# EAGLE design T14_SuperDuper_V_006 (EAGLE 7.1.0)
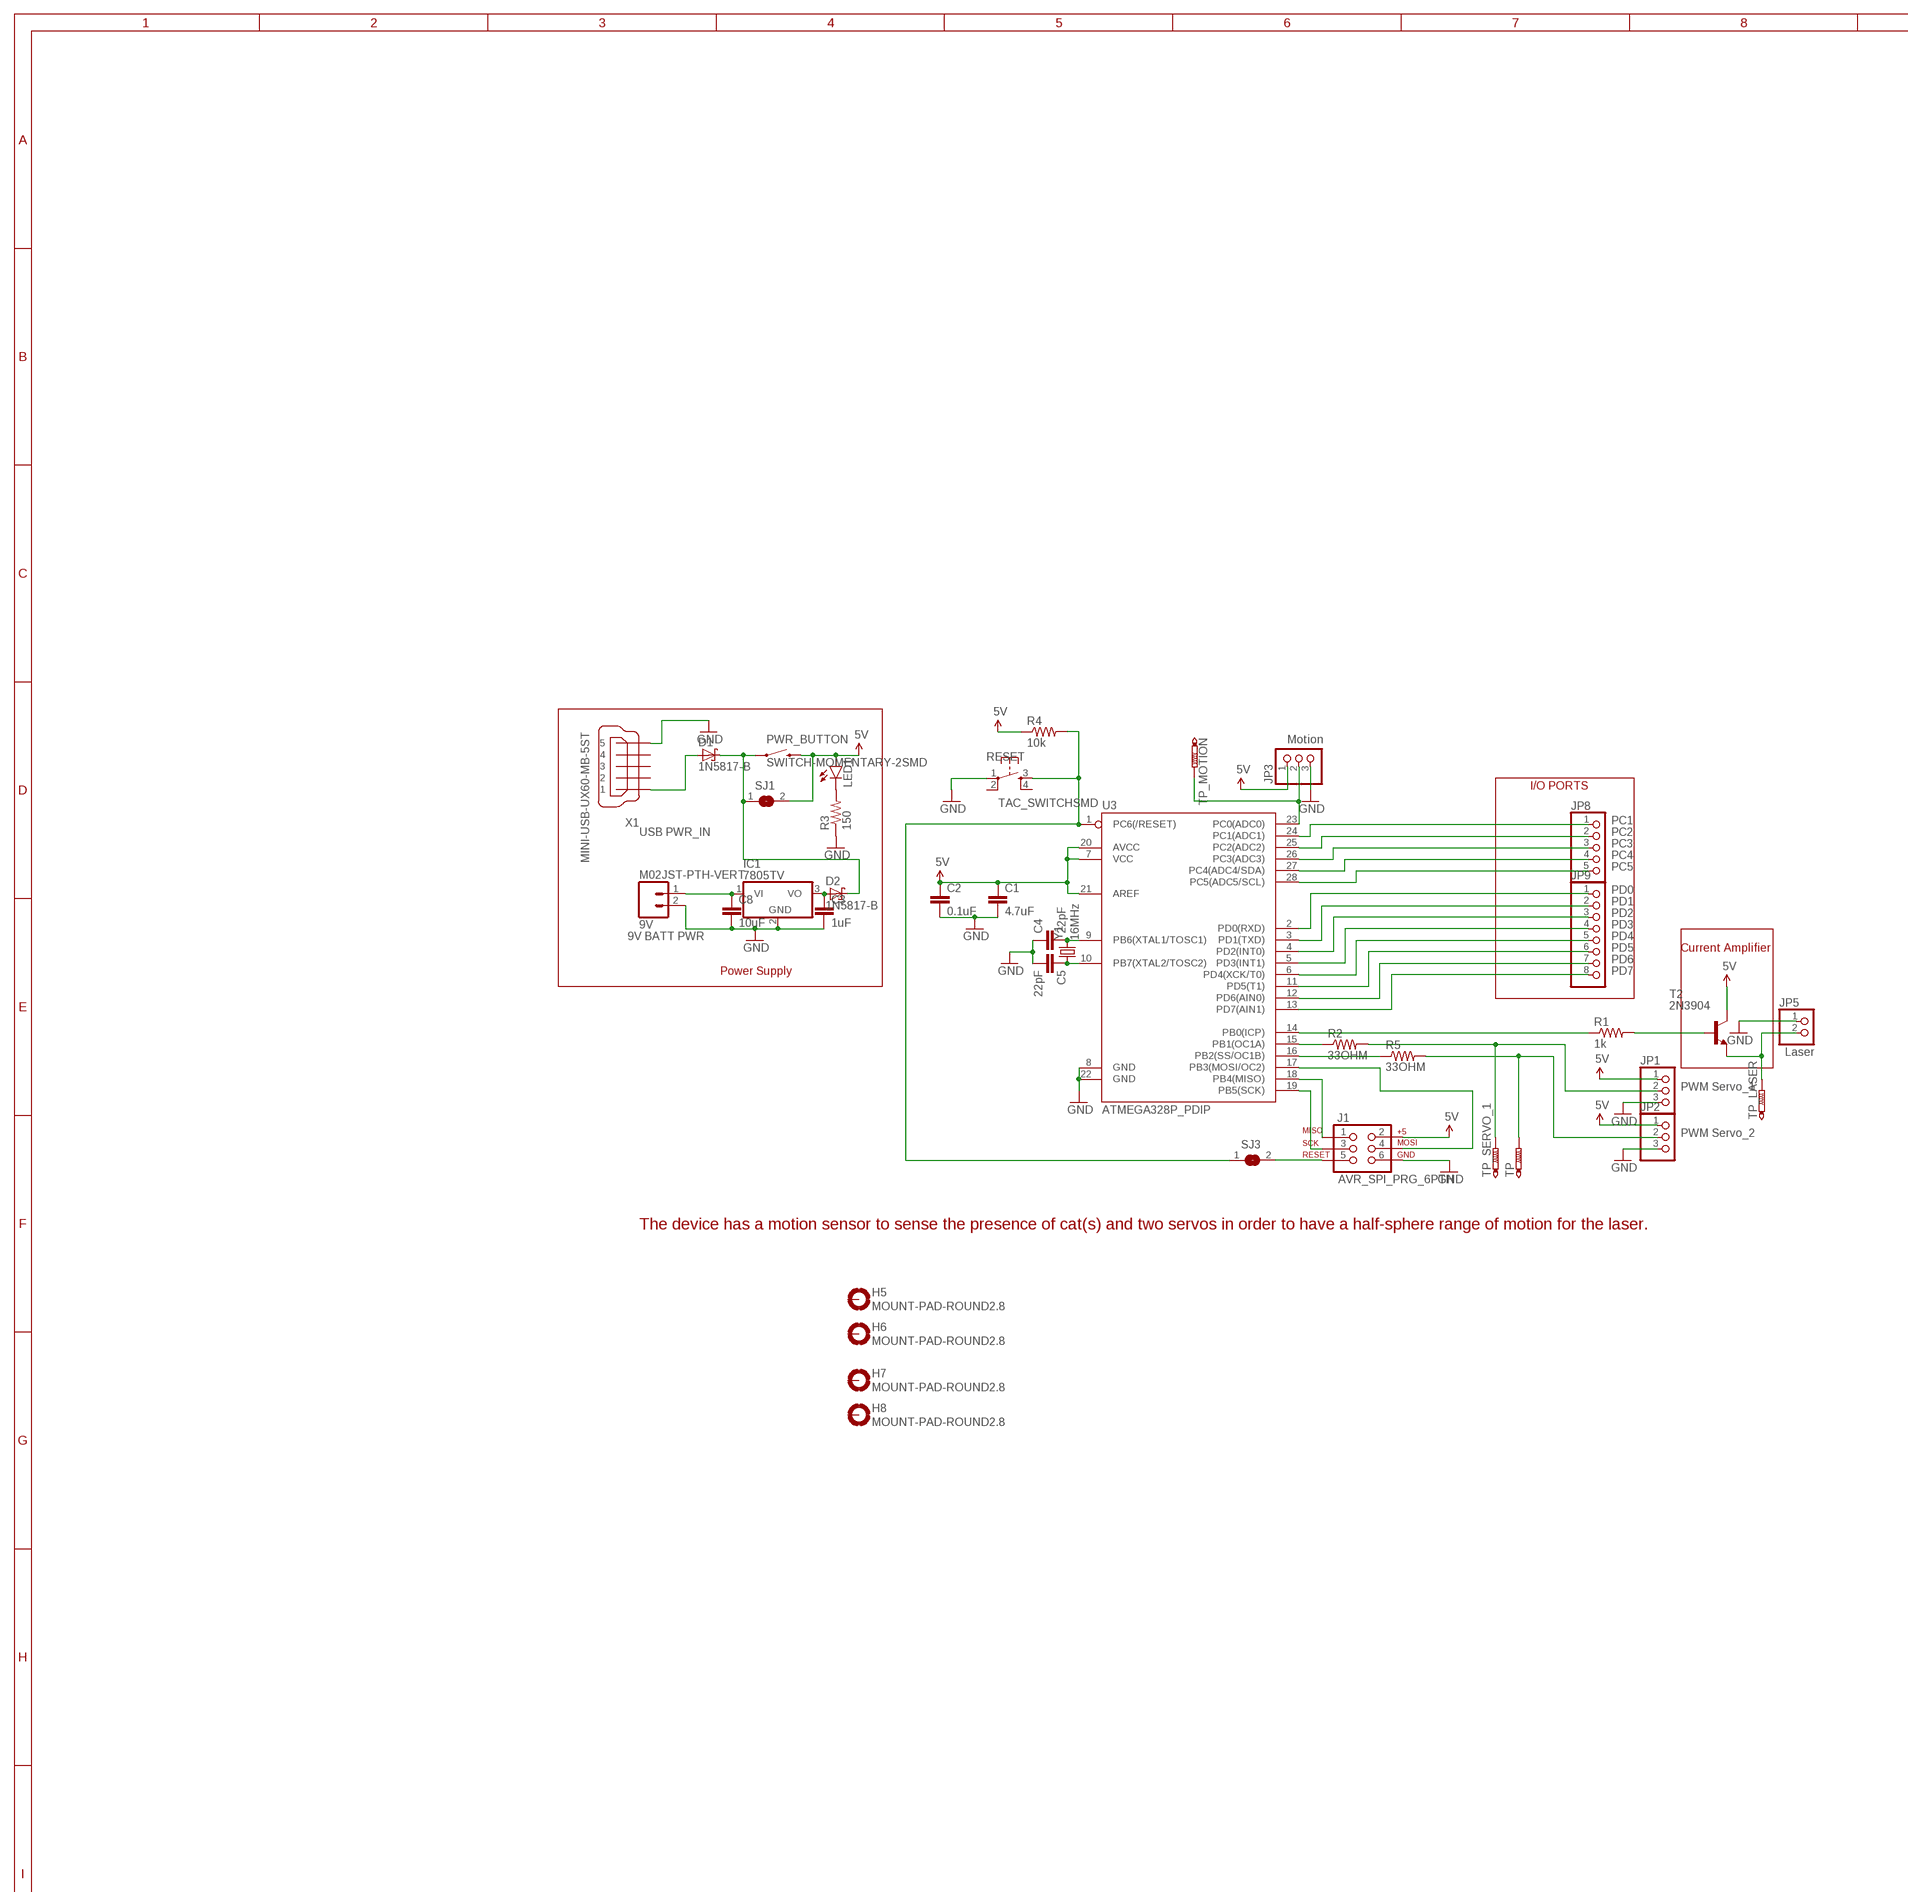
[diagram p0: schematic, sheet 1, part 1 of 2]
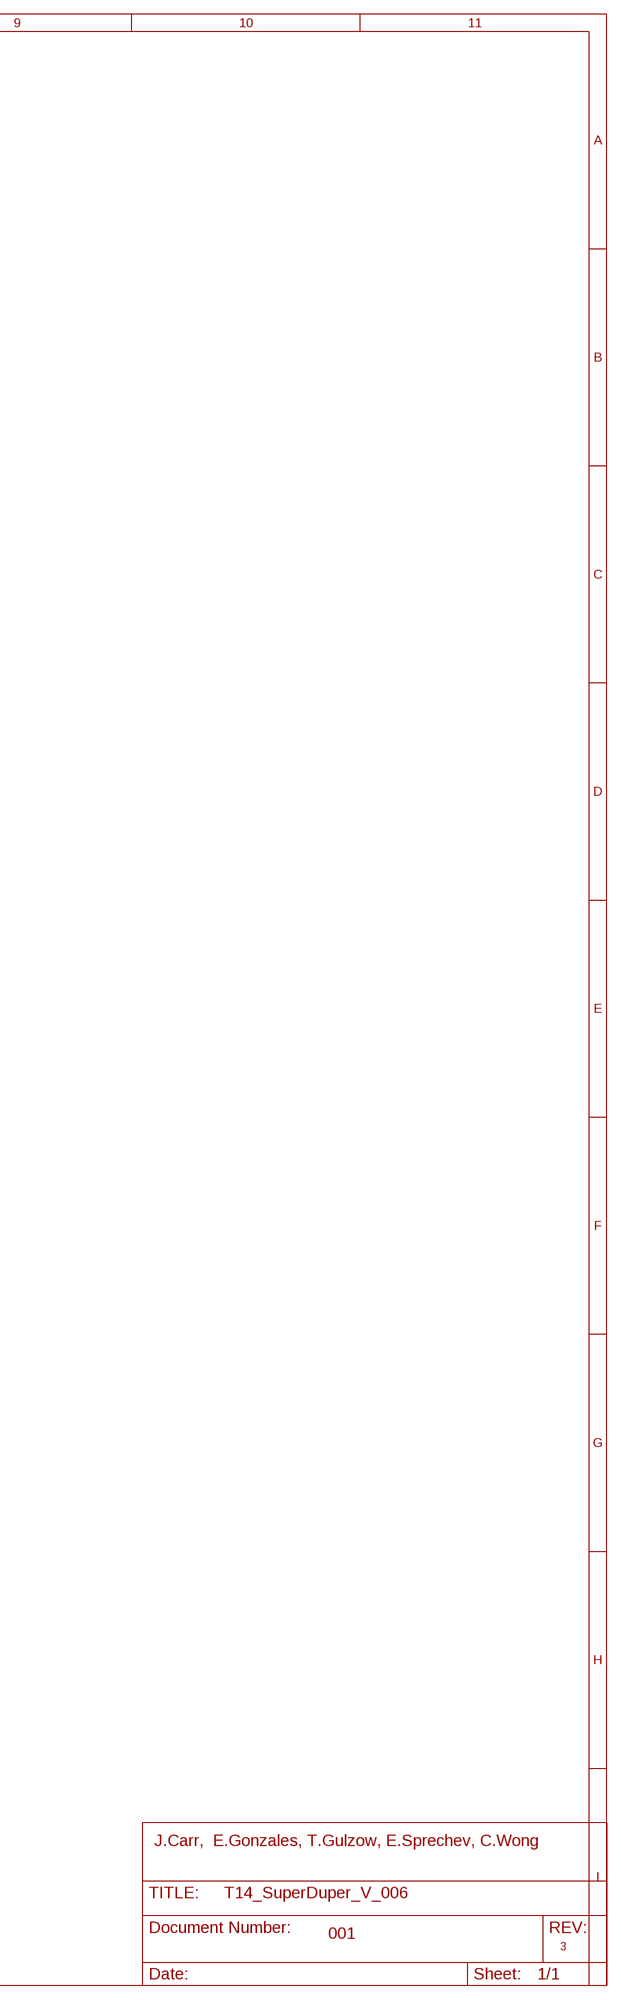
[diagram p1: schematic, sheet 1, part 2 of 2]

## Parts
9V  M02JST-PTH-VERT  [JST-2-PTH-VERT]
C1  4.7uF  4.7UF-6.3V-10%(0603)0603  [0603-CAP]
C2  0.1uF  0.1UF-25V(+80/-20%)(0603)  [0603-CAP]
C3  1uF  0.1UF-25V(+80/-20%)(0603)  [0603-CAP]
C4  22pF  4.7UF-6.3V-10%(0603)0603  [0603-CAP]
C5  22pF  4.7UF-6.3V-10%(0603)0603  [0603-CAP]
C8  10uF  0.1UF-25V(+80/-20%)(0603)  [0603-CAP]
D1  1N5817-B  [DO41-7.6]
D2  1N5817-B  [DO41-7.6]
H5  MOUNT-PAD-ROUND2.8  [2,8-PAD]
H6  MOUNT-PAD-ROUND2.8  [2,8-PAD]
H7  MOUNT-PAD-ROUND2.8  [2,8-PAD]
H8  MOUNT-PAD-ROUND2.8  [2,8-PAD]
IC1  7805TV  [TO220V]
J1  AVR_SPI_PRG_6PTH  [2X3]
JP1  PINHD-1X3  [1X03]
JP2  PINHD-1X3  [1X03]
JP3  PINHD-1X3  [1X03]
JP5  PINHD-1X2  [1X02]
JP8  PINHD-1X5  [1X05]
JP9  PINHD-1X8  [1X08]
LED1  LED-3MM-NO_SILK  [LED3MM-NS]
PWR_BUTTON  SWITCH-MOMENTARY-2SMD  [TACTILE-SWITCH-SMD]
R1  1k  33OHM1/10W1%(0603)  [0603]
R2  33OHM  33OHM1/10W1%(0603)  [0603]
R3  150  33OHM1/10W1%(0603)  [0603]
R4  10k  33OHM1/10W1%(0603)  [0603]
R5  33OHM  33OHM1/10W1%(0603)  [0603]
RESET  TAC_SWITCHSMD  [TACTILE-SWITCH-SMD]
SJ1  SJ  [SJ]
SJ3  SJ  [SJ]
T2  2N3904  [TO92]
TP  PTR1B2,54  [B2,54]
TP_LASER  PTR1B2,54  [B2,54]
TP_MOTION  PTR1B2,54  [B2,54]
TP_SERVO_1  PTR1B2,54  [B2,54]
U3  ATMEGA328P_PDIP  [DIL28-3]
X1  MINI-USB-UX60-MB-5ST  [UX60-MB-5ST]
Y1  16MHz  CRYSTAL10.5X4.8  [CRYSTAL-SMD-10.5X4.8-2PIN]

## Nets
5V: C1.1 C2.1 J1.2 JP1.1 JP2.1 JP3.1 LED1.A PWR_BUTTON.3 R4.1 SJ1.2 T2.1(C) U3.7(VCC) U3.20(AVCC) U3.21(AREF)
GND: 9V.2 C1.2 C2.2 C3.2 C4.1 C5.2 C8.2 IC1.2(GND) J1.6 JP1.3 JP2.3 JP3.3 JP5.1 R3.1 RESET.1 U3.8(GND) U3.22(GND) X1.5
N$1: D1.A X1.1
N$2: R2.1 U3.15(PB1(OC1A))
N$3: R1.2 T2.2(B)
N$4: JP1.2 R2.2 TP_SERVO_1.TP
N$5: C5.1 U3.10(PB7(XTAL2/TOSC2)) Y1.P$1
N$6: R5.1 U3.16(PB2(SS/OC1B))
N$7: JP2.2 R5.2 TP.TP
N$8: 9V.1 C8.1 IC1.1(VI)
N$9: R1.1 U3.14(PB0(ICP))
N$10: C3.1 D2.A IC1.3(VO)
N$11: J1.4 U3.17(PB3(MOSI/OC2))
N$12: J1.1 U3.18(PB4(MISO))
N$13: J1.3 U3.19(PB5(SCK))
N$14: R4.2 RESET.3 SJ3.1 U3.1(PC6(/RESET))
N$15: JP3.2 TP_MOTION.TP U3.23(PC0(ADC0))
N$16: C4.2 U3.9(PB6(XTAL1/TOSC1)) Y1.P$2
N$17: JP8.5 U3.28(PC5(ADC5/SCL))
N$18: JP8.4 U3.27(PC4(ADC4/SDA))
N$19: JP8.3 U3.26(PC3(ADC3))
N$20: JP8.2 U3.25(PC2(ADC2))
N$21: JP8.1 U3.24(PC1(ADC1))
N$22: JP9.1 U3.2(PD0(RXD))
N$23: JP9.2 U3.3(PD1(TXD))
N$24: JP9.3 U3.4(PD2(INT0))
N$25: JP9.4 U3.5(PD3(INT1))
N$26: JP9.5 U3.6(PD4(XCK/T0))
N$27: JP9.6 U3.11(PD5(T1))
N$28: JP9.7 U3.12(PD6(AIN0))
N$29: JP9.8 U3.13(PD7(AIN1))
N$30: JP5.2 T2.3(E) TP_LASER.TP
N$31: D1.C D2.C PWR_BUTTON.1 SJ1.1
N$32: J1.5 SJ3.2
N$33: LED1.K(C) R3.2
Unconnected: H5.B2,8(MOUNT) H6.B2,8(MOUNT) H7.B2,8(MOUNT) H8.B2,8(MOUNT) RESET.2 RESET.4 X1.2 X1.3 X1.4

## Notes on the sheet
- Motion
- I/O PORTS
- PC1
- USB PWR_IN | PC2
- PC3
- PC4
- PC5
- PD0
- PD1
- PD2
- PD3
- 9V BATT PWR | PD4
- PD5 | Current Amplifier
- PD6
- Power Supply | PD7
- Laser
- PWM Servo_1
- PWM Servo_2
- The device has a motion sensor to sense the presence of cat(s) and two servos in order to have a half-sphere range of motion for the laser.
- J.Carr,  E.Gonzales, T.Gulzow, E.Sprechev, C.Wong
- 001
- 3

## Library data of the parts
9V = SparkFun-Connectors:M02: Standard 2-pin 0.1" header. Use with - straight break away headers ( PRT-00116) - right angle break away headers (PRT-00553) - swiss pins (PRT-00743) - machine pins (PRT-00117) - female headers (PRT-00115) Molex polarized connector foot print use with: PRT-08233 with associated crimp pins and housings. 2.54_SCREWTERM for use with PRT-10571. 3.5mm Screw Terminal footprints for PRT-08084 5mm Screw Terminal footprints for use with PRT-08432
C1 = SparkFun-Capacitors:4.7UF-6.3V-10%(0603): CAP-08280; PROD_ID: CAP-08280
C2 = SparkFun-Capacitors:0.1UF-25V(+80/-20%)(0603): CAP-00810 Ceramic Standard decoupling cap; PROD_ID: CAP-00810
C3 C8 = SparkFun-Capacitors:0.1UF-25V(+80/-20%)(0603): CAP-00810 Ceramic Standard decoupling cap; PROD_ID: CAP-00810; VALUE: 0.1uF
C4 C5 = SparkFun-Capacitors:4.7UF-6.3V-10%(0603): CAP-08280; PROD_ID: CAP-08280; VALUE: 4.7uF
D1 D2 = diode:1N581*: 1.0A SCHOTTKY BARRIER RECTIFIER Source: http://www.diodes.com/datasheets/ds23001.pdf
H5-H8 = holes:MOUNT-PAD-ROUND: MOUNTING PAD, round
IC1 = linear:78*: Positive VOLTAGE REGULATOR Source: http://cache.national.com/ds/LM/LM78L05.pdf http://www.fairchildsemi.com/ds/LM/LM7805.pdf
J1 = SparkFun-Connectors:AVR_SPI_PRG_6: AVR ISP 6 Pin This is the reduced ISP connector for AVR programming. Common on Arduino. This footprint will take up less PCB space and can be used with a 10-pin to 6-pin adapter such as SKU: BOB-08508 **Special note about "TEST_POINT" package. The stop mask is on the top side, so if you want your programming test points to be on the bottom of your board, make sure to place this package on the bottom side of the board. This also ensure that the orientation to program from the bottom side will be correct.
JP1-JP3 = pinhead:PINHD-1X3: PIN HEADER
JP5 = pinhead:PINHD-1X2: PIN HEADER
JP8 = pinhead:PINHD-1X5: PIN HEADER
JP9 = pinhead:PINHD-1X8: PIN HEADER
LED1 = SparkFun-LED:LED: LEDs Standard schematic elements and footprints for 5mm, 3mm, 1206, and 0603 sized LEDs. 5mm - Spark Fun Electronics SKU : COM-00529 (and others)
PWR_BUTTON = SparkFun-Electromechanical:SWITCH-MOMENTARY-2: Various NO switches- pushbuttons, reed, etc; PROD_ID: SWCH-08247
R1 R3 R4 = SparkFun-Resistors:33OHM1/10W1%(0603): RES-08270; PROD_ID: RES-08270; VALUE: 33OHM
R2 R5 = SparkFun-Resistors:33OHM1/10W1%(0603): RES-08270; PROD_ID: RES-08270
RESET = SparkFun-Electromechanical:TAC_SWITCH: Momentary Switch Button commonly used for reset or general input. Spark Fun Electronics SKU : COM-00097 SMT- SWCH-08247; PROD_ID: SWCH-08247
SJ1 SJ3 = jumper:SJ: SMD solder JUMPER
T2 = transistor:2N3904: NPN TRANSISTOR
TP TP_LASER TP_MOTION TP_SERVO_1 = testpad:PTR1: TEST PIN
U3 = SparkFun-DigitalIC:ATMEGA328P_PDIP: uC used in the Arduino 32kb flash, 1k EEPROM, 2k SRAM This is the through-hole version of this chip.
X1 = con-hirose:MINI-USB-: MINI USB Connector Source: http://www.hirose.co.jp/cataloge_hp/e24000019.pdf; OC_FARNELL: unknown; OC_NEWARK: unknown
Y1 = SparkFun-FreqCtrl:CRYSTAL: Various standard crystals. Proven footprints. Spark Fun Electronics SKU : COM-00534

## Board
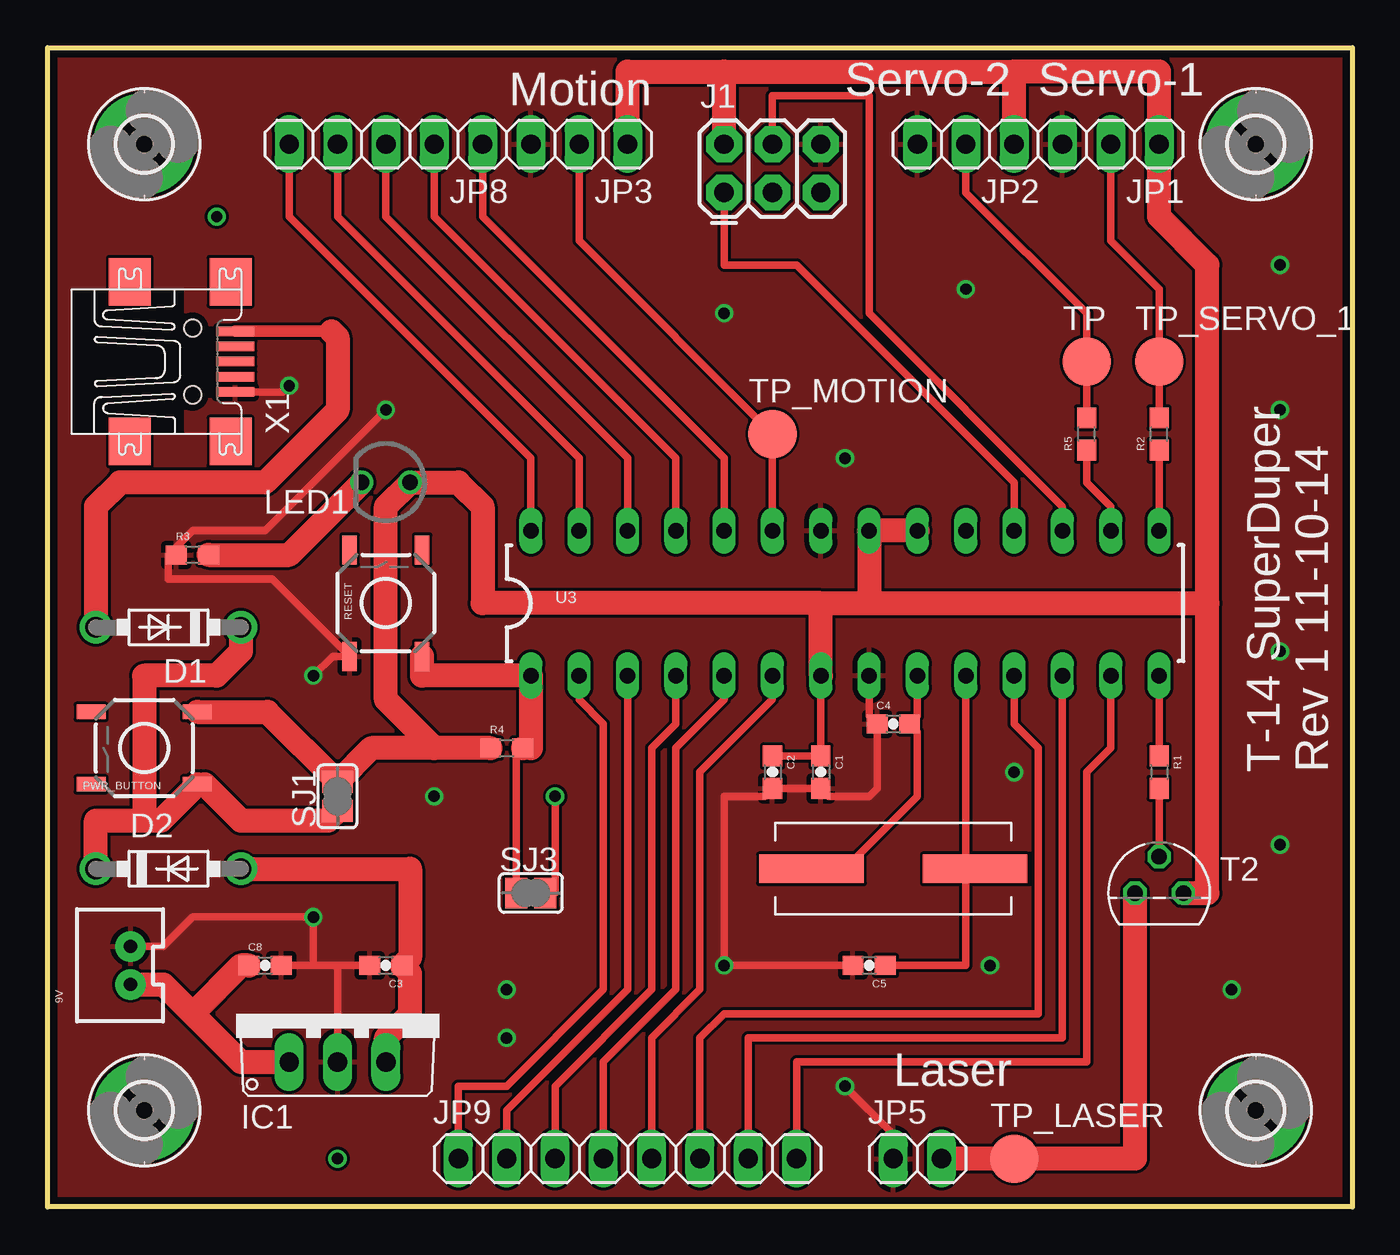
[diagram p2: board, top side]
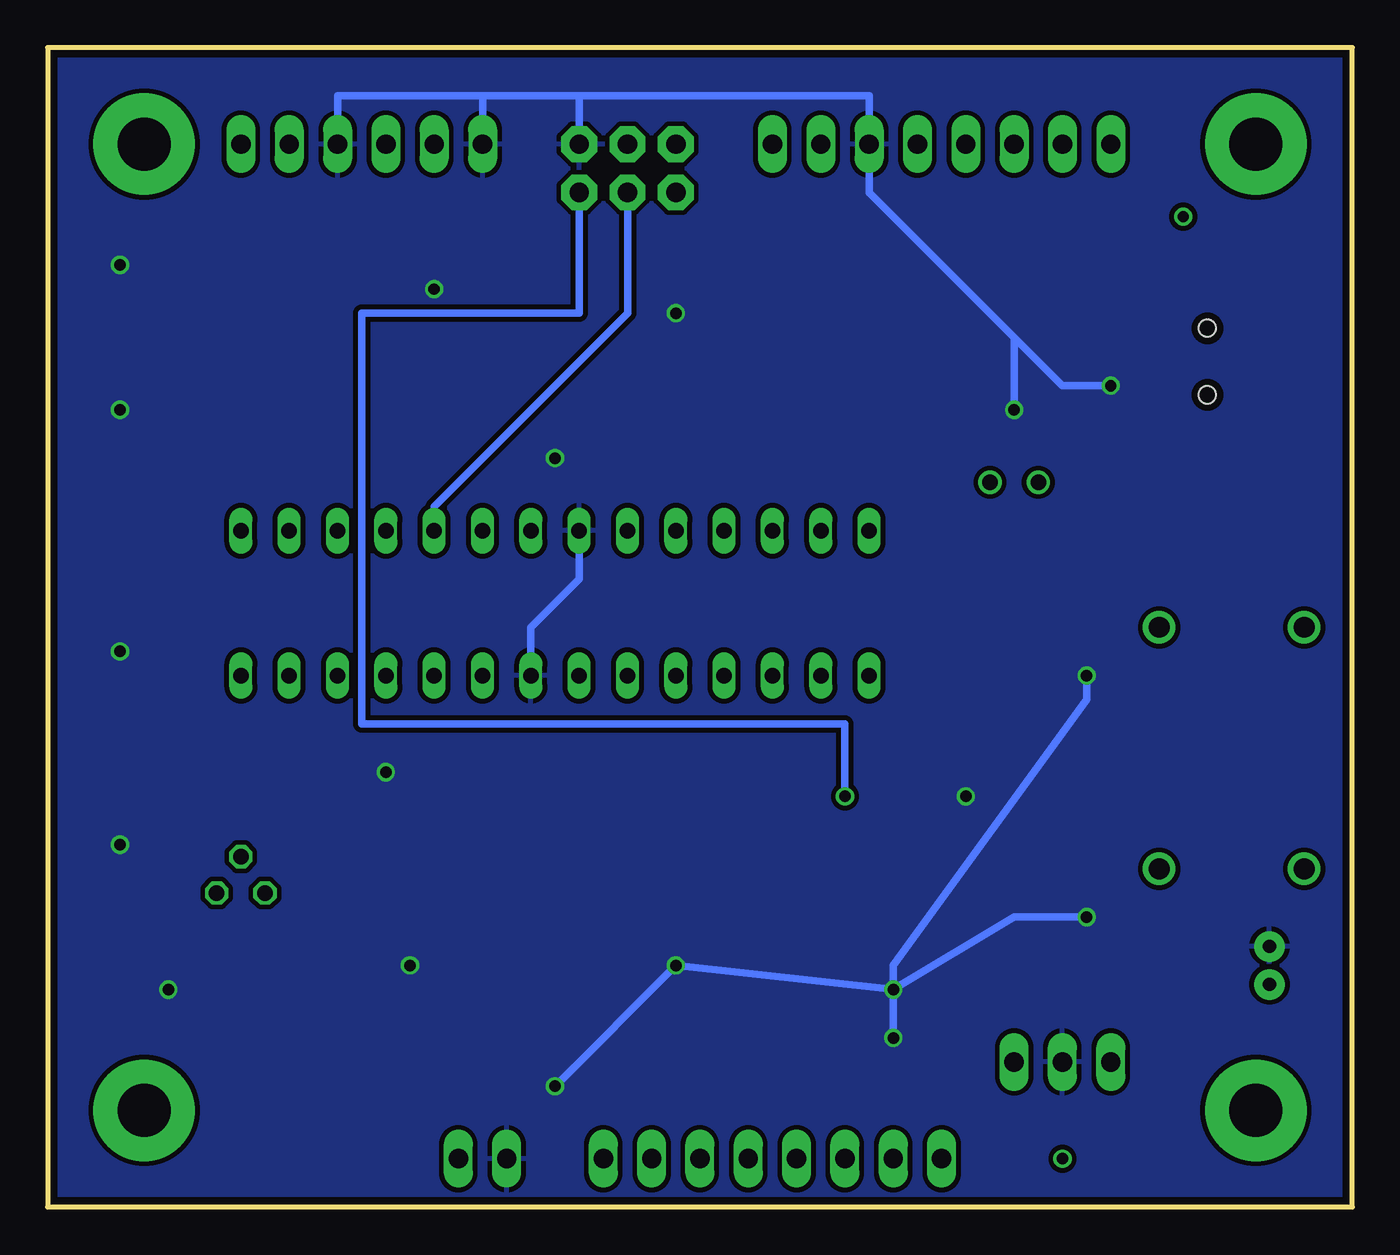
[diagram p3: board, bottom side, seen from below]

Size 68.58 x 60.96 mm. Coordinates in mm from the lower left corner, seen from the top.
Outline: 0,0 0,60.96 68.58,60.96 68.58,0 0,0
Copper layers (1*16): Top 0.0356mm / dielectric 1.5011mm / Bottom 0.0356mm
Design rules "OSH-Park-2-layer": minimum track width 6mil, minimum drill 13mil, track to track 6mil, track to pad 6mil, pad to pad 6mil, via to via 6mil, smd to smd 6mil, copper to edge 15mil, drill to drill 6mil, minimum pad ring 7mil, minimum via ring 7mil, stop-mask expansion 3mil, vias tented up to drill 0mil, thermal gap 10mil

### Footprints (pad centres in the part's own frame; a part is rotated, then mirrored left to right if it is on the bottom)
JST-2-PTH-VERT = drill 0.7 pad 1.6: 1 -1,-0.55; 2 1,-0.55
0603-CAP = smd 1.1 x 1: 1 -0.85,0; 2 0.85,0
DO41-7.6 = drill 1.1 pad 1.7: A 3.81,0; C -3.81,0
2,8-PAD = drill 2.8 pad 5.334: B2,8 0,0
TO220V = drill 1.016 long: 1 -2.54,-2.54; 2 0,-2.54; 3 2.54,-2.54
2X3 = drill 1.016 pad 1.88 octagon: 1 0,0; 2 0,2.54; 3 2.54,0; 4 2.54,2.54; 5 5.08,0; 6 5.08,2.54
1X03 = drill 1.016 long: 1 -2.54,0; 2 0,0; 3 2.54,0
1X02 = drill 1.016 long: 1 -1.27,0; 2 1.27,0
1X05 = drill 1.016 long: 1 -5.08,0; 2 -2.54,0; 3 0,0; 4 2.54,0; 5 5.08,0
1X08 = drill 1.016 long: 1 -8.89,0; 2 -6.35,0; 3 -3.81,0; 4 -1.27,0; 5 1.27,0; 6 3.81,0; 7 6.35,0; 8 8.89,0
LED3MM-NS = drill 0.813: A -1.27,0; K 1.27,0
TACTILE-SWITCH-SMD = smd 1.524 x 0.762: 1 -2.794,1.905; 2 2.794,1.905; 3 -2.794,-1.905; 4 2.794,-1.905
0603 = smd 1.1 x 1: 1 -0.85,0; 2 0.85,0
SJ = smd 1.168 x 1.6: 1 -0.762,0; 2 0.762,0
TO92 = drill 0.813 octagon: 1 1.27,0; 2 0,1.905; 3 -1.27,0
B2,54 = smd 2.54 x 2.54: TP 0,0
DIL28-3 = drill 0.813 long: 1 -16.51,-3.81; 2 -13.97,-3.81; 3 -11.43,-3.81; 4 -8.89,-3.81; 5 -6.35,-3.81; 6 -3.81,-3.81; 7 -1.27,-3.81; 8 1.27,-3.81; 9 3.81,-3.81; 10 6.35,-3.81; 11 8.89,-3.81; 12 11.43,-3.81; 13 13.97,-3.81; 14 16.51,-3.81; 15 16.51,3.81; 16 13.97,3.81; 17 11.43,3.81; 18 8.89,3.81; 19 6.35,3.81; 20 3.81,3.81; 21 1.27,3.81; 22 -1.27,3.81; 23 -3.81,3.81; 24 -6.35,3.81; 25 -8.89,3.81; 26 -11.43,3.81; 27 -13.97,3.81; 28 -16.51,3.81
UX60-MB-5ST = smd 2 x 0.5: 1 2.25,1.6; 2 2.25,0.8; 3 2.25,0; 4 2.25,-0.8; 5 2.25,-1.6 | smd 2.2 x 2.5: M1 -3.3,-4.2; M2 -3.3,4.2; M3 2,4.2; M4 2,-4.2 | hole 0.9: 0,-1.75; 0,1.75
CRYSTAL-SMD-10.5X4.8-2PIN = smd 5.5 x 1.5: P$1 -4.3,0; P$2 4.3,0

### Placement (x,y rotation side)
9V  3.81,12.7 90 top
C1  40.64,22.86 270 top
C2  38.1,22.86 270 top
C3  17.78,12.7 180 top
C4  44.45,25.4 0 top
C5  43.18,12.7 180 top
C8  11.43,12.7 0 top
D1  6.35,30.48 180 top
D2  6.35,17.78 0 top
H5  5.08,55.88 0 top
H6  5.08,5.08 0 top
H7  63.5,5.08 0 top
H8  63.5,55.88 0 top
IC1  15.24,10.16 0 top
J1  35.56,53.34 0 top
JP1  55.88,55.88 180 top
JP2  48.26,55.88 180 top
JP3  27.94,55.88 180 top
JP5  45.72,2.54 0 top
JP8  17.78,55.88 180 top
JP9  30.48,2.54 0 top
LED1  17.78,38.1 180 top
PWR_BUTTON  5.08,24.13 180 top
R1  58.42,22.86 270 top
R2  58.42,40.64 90 top
R3  7.62,34.29 0 top
R4  24.13,24.13 0 top
R5  54.61,40.64 90 top
RESET  17.78,31.75 90 top
SJ1  15.24,21.59 90 top
SJ3  25.4,16.51 0 top
T2  58.42,16.51 0 top
TP  54.61,44.45 0 top
TP_LASER  50.8,2.54 0 top
TP_MOTION  38.1,40.64 0 top
TP_SERVO_1  58.42,44.45 0 top
U3  41.91,31.75 0 top
X1  7.62,44.45 0 top
Y1  44.45,17.78 180 top

### Tracks (layer width: path | path; a pad name or v marks a point on that pad's centre or on a via)
5V
  Top 0.406: U3.7 C1.1 C2.1
  Top 1.27: U3.7 40.64,31.75 | 40.64,31.75 22.86,31.75 22.86,36.83 21.59,38.1 LED1.A 17.78,36.83 17.78,26.67 20.32,24.13 R4.1 17.02,24.13 SJ1.2 11.56,26.04 PWR_BUTTON.3 | 40.64,31.75 43.18,31.75 | 43.18,31.75 60.96,31.75 | T2.1 60.96,16.51 60.96,31.75 | 60.96,31.75 60.96,49.53 58.42,52.07 JP1.1 58.42,59.69 50.8,59.69 | JP2.1 50.8,59.69 | J1.2 35.56,59.69 | U3.20 U3.21 43.18,31.75 | 35.56,59.69 50.8,59.69 | JP3.1 30.48,59.69 35.56,59.69
GND  (via drill 0.6)
  Top 0.406: U3.8 43.18,25.82 C4.1 43.6,22.01 43.18,21.59 41.06,21.59 C1.2 C2.2 37.68,21.59 35.56,21.59 v35.56,12.7 C5.2 | v13.97,27.94 14.99,28.96 RESET.1 11.81,33.02 6.35,33.02 6.35,34.29 R3.1 6.77,34.71 7.62,35.56 11.43,35.56 v17.78,41.91 | JP5.1 44.45,3.81 v41.91,6.35 | X1.5 12.37,42.85 v12.7,43.18 | 9V.2 6.08,13.7 7.62,15.24 v13.97,15.24 13.97,12.7 | C8.2 13.97,12.7 | C3.2 15.24,12.7 | 15.24,12.7 13.97,12.7 | IC1.2 15.24,12.7
  Bottom 0.406: U3.22 40.64,33.02 43.18,30.48 U3.8 | J1.6 40.64,58.42 | 40.64,58.42 45.72,58.42 | JP2.3 45.72,58.42 | 45.72,58.42 53.34,58.42 JP1.3 | 40.64,58.42 25.4,58.42 JP3.3 25.4,53.34 17.78,45.72 | v24.13,11.43 v35.56,12.7 v41.91,6.35 | v13.97,27.94 13.97,26.67 24.13,12.7 v24.13,11.43 | v12.7,43.18 15.24,43.18 17.78,45.72 | v17.78,41.91 17.78,45.72 | v13.97,15.24 17.78,15.24 v24.13,11.43 | v24.13,11.43 v24.13,8.89
  other vias: 62.23,11.43 64.77,19.05 64.77,29.21 64.77,41.91 64.77,49.53 48.26,48.26 35.56,46.99 41.91,39.37 50.8,22.86 49.53,12.7 20.32,21.59
  pour Top: 0,0 0,60.96 68.58,60.96 68.58,0
  pour Bottom (isolate 0.254): 0,60.96 68.58,60.96 68.58,0 0,0
N$1
  Top 0.61: 14.91,46.05 X1.1
  Top 1.27: 14.91,46.05 15.24,45.72 15.24,41.91 11.43,38.1 3.81,38.1 2.54,36.83 D1.A
N$2
  Top 0.406: U3.15 R2.1
N$3
  Top 0.406: R1.2 T2.2
N$4
  Top 0.406: R2.2 TP_SERVO_1.TP 58.42,48.26 55.88,50.8 JP1.2
N$5
  Top 0.406: U3.10 48.26,18.27 Y1.P$1 48.26,17.78 48.26,12.7 C5.1
N$6
  Top 0.406: R5.1 54.61,38.1 55.88,36.83 U3.16
N$7
  Top 0.406: JP2.2 48.26,53.34 54.61,46.99 TP.TP R5.2
N$8
  Top 1.27: 9V.1 6.08,11.7 7.62,10.16 | 7.62,10.16 10.16,7.62 IC1.1 | C8.1 10.16,12.7 7.62,10.16
N$9
  Top 0.406: U3.14 R1.1
N$10
  Top 1.27: IC1.3 17.78,8.89 19.05,10.16 19.05,12.28 C3.1 19.05,13.12 19.05,17.78 D2.A
N$11
  Top 0.406: J1.4 38.1,58.42 43.18,58.42 43.18,46.99 53.34,36.83 U3.17
N$12
  Top 0.406: U3.18 50.8,38.1 39.37,49.53 35.56,49.53 J1.1
N$13
  Bottom 0.406: U3.19 48.26,36.83 38.1,46.99 J1.3
N$14
  Top 0.406: RESET.3 19.68,28.57 | SJ3.1 24.64,23.79 R4.2
  Top 1.27: RESET.3 19.68,27.94 U3.1 25.4,24.13 R4.2
N$15
  Top 0.406: JP3.2 27.94,50.8 TP_MOTION.TP U3.23
N$16
  Top 0.406: Y1.P$2 41.91,17.78 45.72,21.59 45.72,24.98 C4.2 45.72,25.82 U3.9
N$17
  Top 0.406: U3.28 25.4,39.37 12.7,52.07 JP8.5
N$18
  Top 0.406: U3.27 27.94,39.37 15.24,52.07 JP8.4
N$19
  Top 0.406: U3.26 30.48,39.37 17.78,52.07 JP8.3
N$20
  Top 0.406: U3.25 33.02,39.37 20.32,52.07 JP8.2
N$21
  Top 0.406: U3.24 35.56,39.37 22.86,52.07 JP8.1
N$22
  Top 0.406: U3.2 27.94,26.67 29.21,25.4 29.21,11.43 24.13,6.35 21.59,6.35 JP9.1
N$23
  Top 0.406: U3.3 30.48,11.43 24.13,5.08 JP9.2
N$24
  Top 0.406: U3.4 33.02,25.4 31.75,24.13 31.75,11.43 26.67,6.35 JP9.3
N$25
  Top 0.406: U3.5 35.56,26.67 33.02,24.13 33.02,11.43 29.21,7.62 JP9.4
N$26
  Top 0.406: U3.6 38.1,26.67 34.29,22.86 34.29,11.43 31.75,8.89 JP9.5
N$27
  Top 0.406: U3.11 50.8,25.4 52.07,24.13 52.07,10.16 35.56,10.16 34.29,8.89 JP9.6
N$28
  Top 0.406: U3.12 53.34,8.89 36.83,8.89 JP9.7
N$29
  Top 0.406: U3.13 55.88,24.13 54.61,22.86 54.61,7.62 39.37,7.62 JP9.8
N$30
  Top 1.27: T2.3 57.15,6.35 57.15,2.54 TP_LASER.TP JP5.2
N$31
  Top 1.27: D2.C 2.54,20.32 5.08,20.32 | 5.08,20.32 5.97,20.32 PWR_BUTTON.1 8.26,22.23 10.16,20.32 14.73,20.32 SJ1.1 | D1.C 10.16,29.21 8.89,27.94 5.08,27.94 5.08,20.32
N$32  (via drill 0.6)
  Top 0.406: SJ3.2 26.67,16.51 v26.67,21.59
  Bottom 0.406: v26.67,21.59 26.67,25.4 52.07,25.4 52.07,46.99 40.64,46.99 J1.5
N$33
  Top 1.27: R3.2 12.7,34.29 LED1.K
N$44  (via drill 0.6)
  other vias: 15.24,2.54
N$46  (via drill 0.6)
  other vias: 8.89,52.07
N$47
  pour Top (isolate 0.254): 0,60.96 68.58,60.96 68.58,0 0,0

### Text on the board
tPlace: Motion | Servo-2 | Servo-1 | T-14 SuperDuper | Rev 1 11-10-14 | Laser